# EAGLE design dmxshield (EAGLE 5.09)
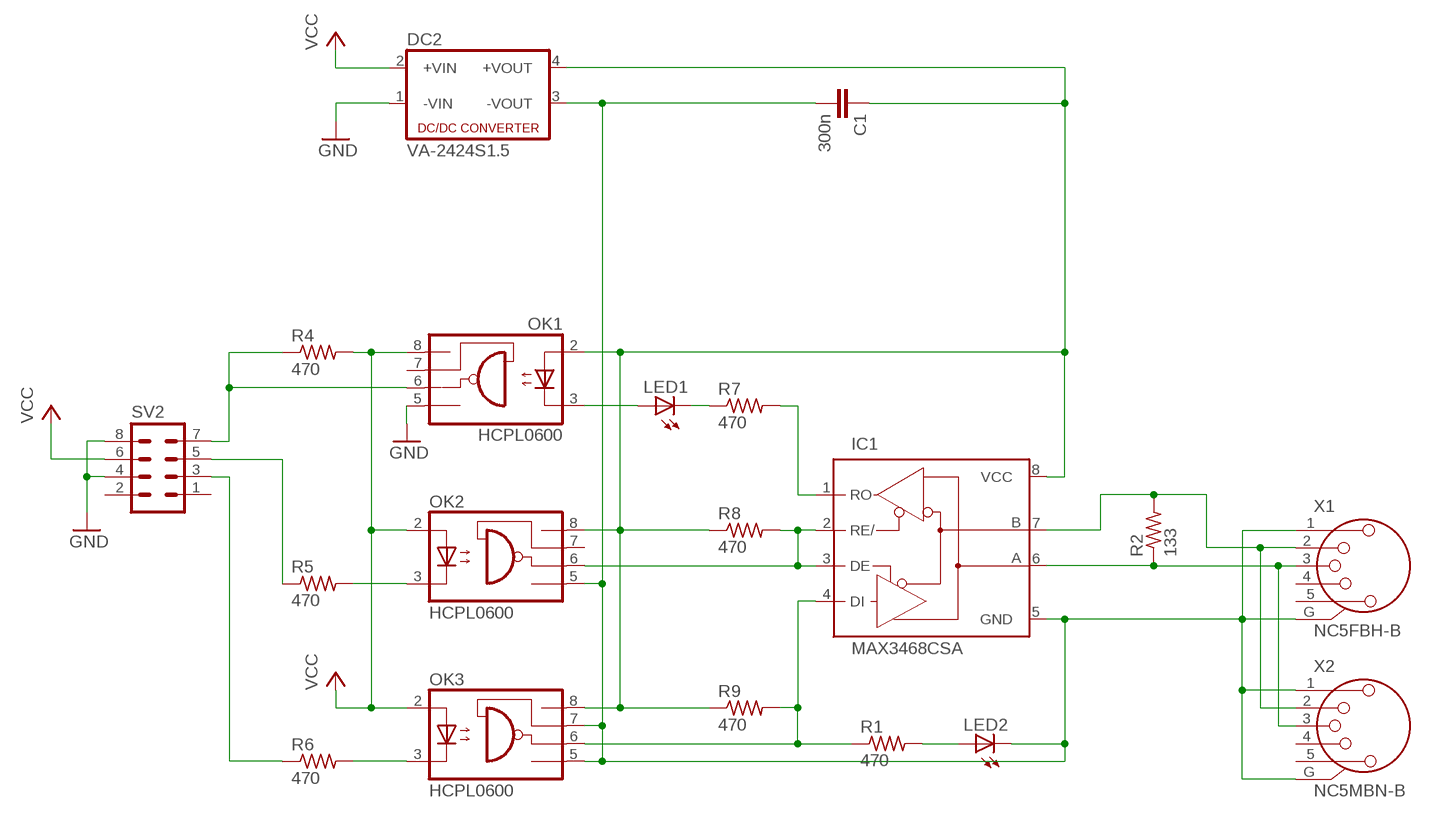
[diagram p0: schematic, sheet 1]

## Parts
C1  300n  C-EUC0805  [C0805]
DC2  VA-2424S1.5  [4SIL]
IC1  MAX3468CSA  [SO08]
LED1  LEDCHIP-LED0805  [CHIP-LED0805]
LED2  LEDCHIP-LED0805  [CHIP-LED0805]
OK1  HCPL0600  [SOIC08]
OK2  HCPL0600  [SOIC08]
OK3  HCPL0600  [SOIC08]
R1  470  R-US_R0805  [R0805]
R2  133  R-US_R0805  [R0805]
R4  470  R-US_R0805  [R0805]
R5  470  R-US_R0805  [R0805]
R6  470  R-US_R0805  [R0805]
R7  470  R-US_R0805  [R0805]
R8  470  R-US_R0805  [R0805]
R9  470  R-US_R0805  [R0805]
SV2  MA04-2  [MA04-2]
X1  NC5FBH-B  [NC5FBH-B]
X2  NC5MBN-B  [NC5MBH-B]

## Nets
GND: DC2.1(-VIN) OK1.5(GND) SV2.4 SV2.8
N$1: OK1.6(VO) R4.1 SV2.7
N$2: OK2.3(C) R5.2
N$3: R5.1 SV2.5
N$4: OK3.3(C) R6.2
N$5: LED1.A OK1.3(C)
N$6: C1.1 DC2.4(+VOUT) IC1.8(VCC) OK1.2(A) OK2.8(VCC) OK3.8(VCC) R8.1 R9.1
N$7: C1.2 DC2.3(-VOUT) IC1.5(GND) LED2.C OK2.5(GND) OK3.5(GND) OK3.7(VE) X1.1 X1.G X2.1 X2.G
N$8: IC1.2(RE/) IC1.3(DE) OK2.6(VO) R8.2
N$9: LED1.C R7.1
N$10: IC1.1(RO) R7.2
N$11: LED2.A R1.2
N$13: IC1.4(DI) OK3.6(VO) R1.1 R9.2
N$14: IC1.7(B) R2.2 X1.2 X2.2
N$15: IC1.6(A) R2.1 X1.3 X2.3
N$16: R6.1 SV2.3
VCC: DC2.2(+VIN) OK1.8(VCC) OK2.2(A) OK3.2(A) R4.2 SV2.6
Unconnected: OK1.7(VE) OK2.7(VE) SV2.1 SV2.2 X1.4 X1.5 X2.4 X2.5

## Library data of the parts
C1 = resistor:C-EU: CAPACITOR, European symbol
DC2 = dc-dc-converter:VA-*?: DC DC Converter Single Output, 1 Watt Motien Technology Co.,Ltd. Source: va-serie.pdf
IC1 = maxim:MAX34*: +5V, Fail-Safe, 40Mbps, Profibus RS-485/RS-422 Transceivers Source: MAX3465-MAX3469.pdf
LED1 LED2 = led:LED: LED OSRAM: - CHIPLED LG R971, LG N971, LY N971, LG Q971, LY Q971, LO R971, LY R971 LH N974, LH R974 LS Q976, LO Q976, LY Q976 LO Q996 - Hyper CHIPLED LW Q18S LB Q993, LB Q99A, LB R99A - SideLED LS A670, LO A670, LY A670, LG A670, LP A670 LB A673, LV A673, LT A673, LW A673 LH A674 LY A675 LS A676, LA A676, LO A676, LY A676, LW A676 LS A679, LY A679, LG A679 - Hyper Micro SIDELED® LS Y876, LA Y876, LO Y876, LY Y876 LT Y87S - SmartLED LW L88C, LW L88S LB L89C, LB L89S, LG L890 LS L89K, LO L89K, LY L89K LS L896, LA L896, LO L896, LY L896 - TOPLED LS T670, LO T670, LY T670, LG T670, LP T670 LSG T670, LSP T670, LSY T670, LOP T670, LYG T670 LG T671, LOG T671, LSG T671 LB T673, LV T673, LT T673, LW T673 LH T674 LS T676, LA T676, LO T676, LY T676, LB T676, LH T676, LSB T676, LW T676 LB T67C, LV T67C, LT T67C, LS T67K, LO T67K, LY T67K, LW E67C LS E67B, LA E67B, LO E67B, LY E67B, LB E67C, LV E67C, LT E67C LW T67C LS T679, LY T679, LG T679 LS T770, LO T770, LY T770, LG T770, LP T770 LB T773, LV T773, LT T773, LW T773 LH T774 LS E675, LA E675, LY E675, LS T675 LS T776, LA T776, LO T776, LY T776, LB T776 LHGB T686 LT T68C, LB T68C - Hyper Mini TOPLED® LB M676 - Mini TOPLED Santana® LG M470 LS M47K, LO M47K, LY M47K Source: http://www.osram.convergy.de LUXEON: - LUMILED® LXK2-PW12-R00, LXK2-PW12-S00, LXK2-PW14-U00, LXK2-PW14-V00 LXK2-PM12-R00, LXK2-PM12-S00, LXK2-PM14-U00 LXK2-PE12-Q00, LXK2-PE12-R00, LXK2-PE12-S00, LXK2-PE14-T00, LXK2-PE14-U00 LXK2-PB12-K00, LXK2-PB12-L00, LXK2-PB12-M00, LXK2-PB14-N00, LXK2-PB14-P00, LXK2-PB14-Q00 LXK2-PR12-L00, LXK2-PR12-M00, LXK2-PR14-Q00, LXK2-PR14-R00 LXK2-PD12-Q00, LXK2-PD12-R00, LXK2-PD12-S00 LXK2-PH12-R00, LXK2-PH12-S00 LXK2-PL12-P00, LXK2-PL12-Q00, LXK2-PL12-R00 Source: www.luxeon.com KINGBRIGHT: KA-3528ASYC Source: www.kingbright.com
OK1-OK3 = optocoupler:HCPL0600: HEWLETT PACKARD OPTO COUPLER
R1 R2 R4-R9 = resistor:R-US_: RESISTOR, American symbol
SV2 = con-lstb:MA04-2: PIN HEADER
X1 X2 = con-neutrik_ag:NC5: Neutrik Audio Connector XLR SERIES Stereo 1/4" jack Source: www.neutrik.com/

## Board
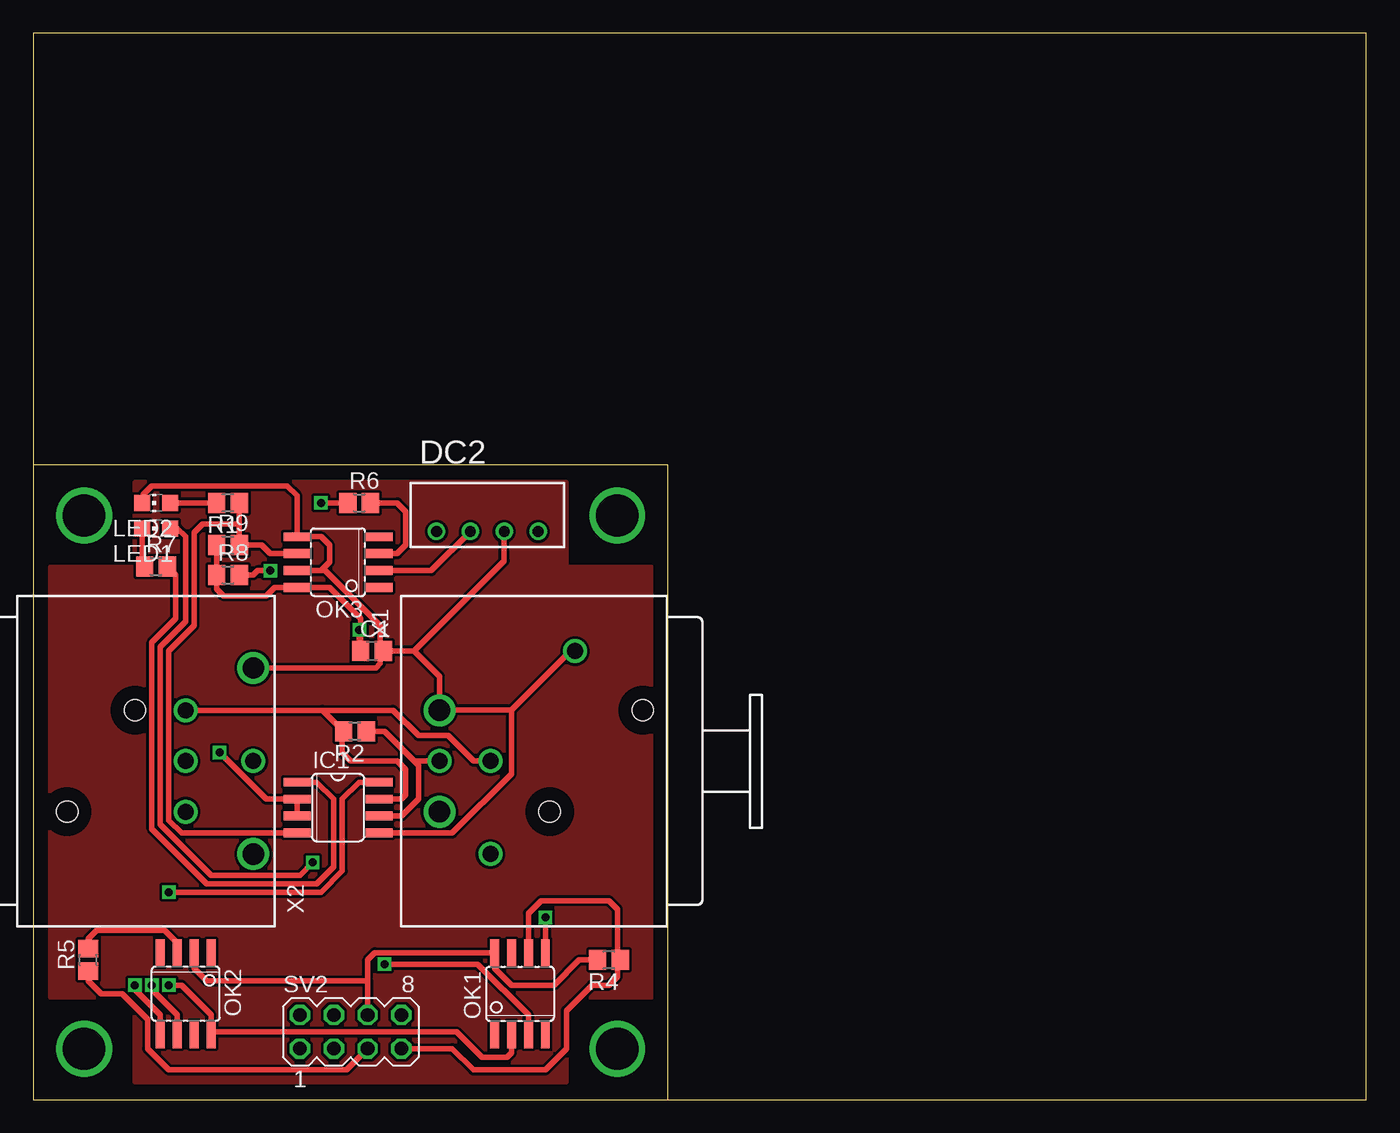
[diagram p1: board, top side]
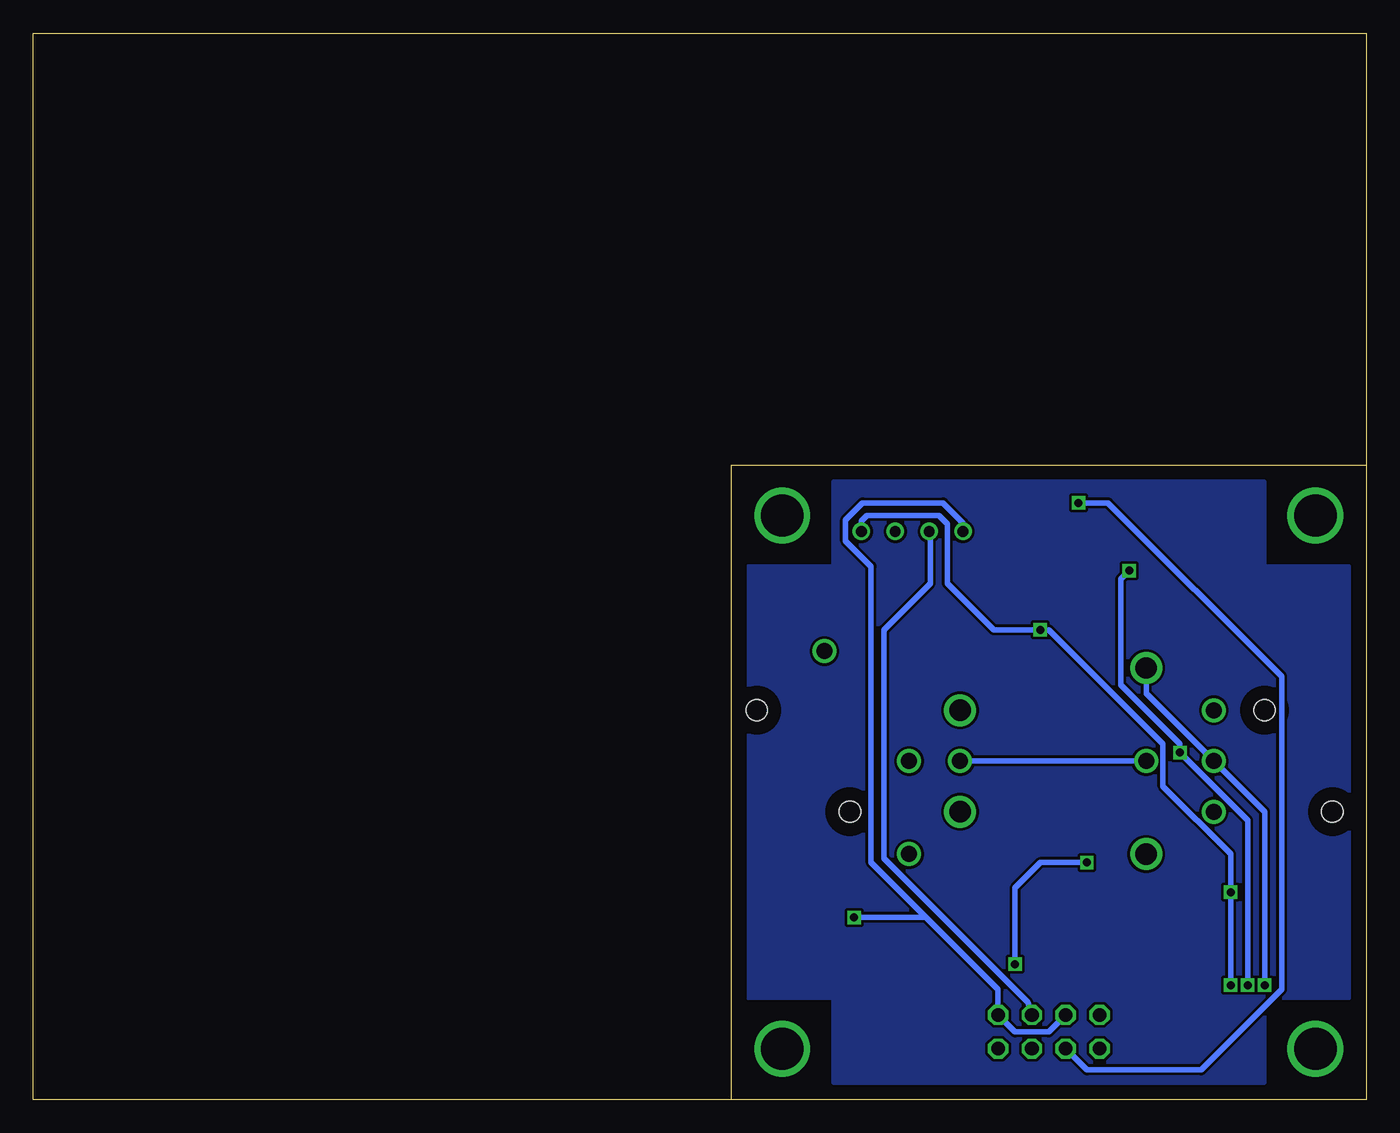
[diagram p2: board, bottom side, seen from below]

Size 100 x 80 mm. Coordinates in mm from the lower left corner, seen from the top.
Outline: 47.62,0 100,0 100,80 0,80 0,47.62
Outline: 47.62,0 0,0 0,47.62
Outline: 47.62,0 47.62,47.62 0,47.62
Copper layers (1*16): Top 0.035mm / dielectric 1.5mm / Bottom 0.035mm
Design rules "default": minimum track width 10mil, minimum drill 24mil, track to track 8mil, track to pad 8mil, pad to pad 8mil, via to via 8mil, smd to smd 8mil, copper to edge 40mil, drill to drill 8mil, minimum pad ring 10mil, minimum via ring 8mil, stop-mask expansion 4mil, vias tented up to drill 0mil, thermal gap 10mil
tKeepout: area 15.1,0.5 to 32.5,9.7

### Footprints (pad centres in the part's own frame; a part is rotated, then mirrored left to right if it is on the bottom)
C0805 = smd 1.3 x 1.5: 1 -0.85,0; 2 0.85,0
4SIL = drill 0.8 round: 1 -3.81,0; 2 -1.27,0; 3 1.27,0; 4 3.81,0
SO08 = smd 0.66 x 2.032: 1 -1.905,-3.073; 2 -0.635,-3.073; 3 0.635,-3.073; 4 1.905,-3.073; 5 1.905,3.073; 6 0.635,3.073; 7 -0.635,3.073; 8 -1.905,3.073
CHIP-LED0805 = smd 1.2 x 1.2: A 0,-1.05; C 0,1.05
SOIC08 = smd 0.66 x 2.032: 1 -1.905,-3.073; 2 -0.635,-3.073; 3 0.635,-3.073; 4 1.905,-3.073; 5 1.905,3.073; 6 0.635,3.073; 7 -0.635,3.073; 8 -1.905,3.073
R0805 = smd 1.3 x 1.5: 1 -0.85,0; 2 0.85,0
MA04-2 = drill 1.016 octagon: 1 -3.81,-1.27; 2 -3.81,1.27; 3 -1.27,-1.27; 4 -1.27,1.27; 5 1.27,-1.27; 6 1.27,1.27; 7 3.81,-1.27; 8 3.81,1.27
NC5FBH-B = drill 1.6 round: 1 -3.81,-3.815; 5 3.81,-3.815 | drill 1.2 round: 2 0,0; 3 0,-3.815; 4 6.98,0; G -8.25,6.355 | hole 1.6: 3.81,4.445; -3.81,11.43
NC5MBH-B = drill 1.6 round: 1 6.98,-5.08; 5 -6.98,-5.08 | drill 1.2 round: 2 3.81,0; 3 0,-5.08; 4 -3.81,0; G 0,0 | hole 1.6: 3.81,3.81; -3.81,8.89

### Placement (x,y rotation side)
C1  25.4,33.66 0 top
DC2  34.06,42.62 0 top
IC1  22.86,21.91 270 top
LED1  9.21,42.86 90 top
LED2  9.21,44.77 90 top
OK1  36.51,7.94 0 top
OK2  11.43,7.94 180 top
OK3  22.86,40.32 90 top
R1  14.61,44.77 180 top
R2  24.13,27.62 180 top
R4  43.18,10.48 180 top
R5  4.13,10.48 90 top
R6  24.45,44.77 0 top
R7  9.21,40.01 0 top
R8  14.61,39.37 0 top
R9  14.61,41.59 0 top
SV2  23.81,5.08 0 top
X1  34.29,25.4 270 top
X2  11.43,25.4 90 top

### Tracks (layer width: path | path; a pad name or v marks a point on that pad's centre or on a via)
GND  (via drill 0.6)
  Top 0.406: v38.42,13.65 OK1.5
  Bottom 0.406: SV2.4 23.81,5.08 26.35,5.08 SV2.8 27.62,8.26 33.02,13.65 | 33.02,13.65 v38.42,13.65 | DC2.1 30.25,43.27 31.75,44.77 37.78,44.77 39.05,43.5 39.05,41.91 37.15,40.01 37.15,17.78 33.02,13.65
MOUNT  (via drill 3.17 pad 3.17)
  other vias: 3.81,43.81 43.81,43.81 3.81,3.81 43.81,3.81
N$1
  Top 0.406: OK1.6 37.15,13.97 38.1,14.92 43.18,14.92 43.81,14.29 43.81,10.69 R4.1 43.81,10.26 43.81,9.21 43.18,8.57 41.91,8.57 40.01,6.67 40.01,3.81 38.42,2.22 33.02,2.22 31.43,3.81 SV2.7
N$2
  Top 0.406: OK2.3 10.79,11.75 9.84,12.7 4.76,12.7 4.13,12.06 R5.2
N$3
  Top 0.406: R5.1 4.13,8.89 5.08,7.94 6.67,7.94 8.57,6.03 8.57,3.81 10.16,2.22 23.5,2.22 SV2.5
N$4
  Top 0.406: R6.2 27.3,44.77 27.94,44.13 27.94,41.59 27.3,40.96 OK3.3
N$5  (via drill 0.6)
  Top 0.406: LED1.A 10.79,42.86 11.43,42.23 11.43,35.88 9.53,33.97 9.53,20.64 13.34,16.83 20,16.83 v20.95,17.78 | v26.35,10.16 33.34,10.16 37.15,6.35 OK1.3
  Bottom 0.406: v20.95,17.78 24.45,17.78 26.35,15.88 v26.35,10.16
N$6  (via drill 0.6)
  Top 0.406: R9.1 R8.1 13.76,38.31 14.29,37.78 17.46,37.78 18.1,38.42 OK3.8 22.23,38.42 24.55,36.09 C1.1 24.45,33.76 v24.45,35.24 | v10.16,8.57 11.11,8.57 13.34,6.35 OK2.8 13.55,5.08 31.75,5.08 33.66,3.17 35.56,3.17 35.88,3.49 OK1.2 | IC1.8 24.45,23.81 23.18,22.54 23.18,17.14 21.59,15.56 v10.16,15.56
  Bottom 0.406: DC2.4 37.87,43.41 37.47,43.81 32.07,43.81 31.43,43.18 31.43,38.73 27.94,35.24 v24.45,35.24 23.81,35.24 15.24,26.67 15.24,23.5 10.16,18.41 v10.16,15.56 v10.16,8.57
N$7  (via drill 0.6)
  Top 0.406: LED2.C 8.26,45.3 8.26,45.4 8.89,46.04 19.05,46.04 19.79,45.3 OK3.5 21.59,42.23 22.23,41.59 22.23,40.32 21.59,39.69 OK3.7 21.91,39.69 26.04,35.56 26.04,33.87 C1.2 | X2.1 25.71,32.38 26.04,32.7 26.04,33.44 C1.2 | X1.1 | 35.87,29.21 X1.1 | 35.87,29.21 35.88,29.21 35.88,24.45 31.43,20 IC1.5 | v7.62,8.57 7.62,8.26 9.53,6.35 OK2.5 | X1.1 30.48,31.75 28.57,33.66 | DC2.3 35.33,40.41 28.57,33.66 | X1.G 40.31,33.65 35.87,29.21 | 28.57,33.66 C1.2
  Bottom 0.406: v7.62,8.57 7.62,21.59 X2.G 16.51,30.48 X2.1
N$8  (via drill 0.6)
  Top 0.406: IC1.3 IC1.2 17.46,22.54 v13.97,26.04 | R8.2 16.51,39.37 16.83,39.69 v17.78,39.69 | v8.89,8.57 8.89,8.26 10.79,6.35 OK2.6
  Bottom 0.406: v17.78,39.69 18.41,39.05 18.41,31.11 13.97,26.67 v13.97,26.04 8.89,20.95 v8.89,8.57
N$9
  Top 0.406: LED1.C 8.16,40.2 R7.1
N$10
  Top 0.406: IC1.1 21.27,23.81 22.54,22.54 22.54,17.46 21.27,16.19 13.02,16.19 8.89,20.32 8.89,34.29 10.69,36.09 10.69,39.37 R7.2
N$11
  Top 0.406: R1.2 LED2.A
N$12
  pour Bottom: 1.27,7.62 1.27,40.01 7.62,40.01 7.62,46.35 40.01,46.35 40.01,40.01 46.35,40.01 46.35,7.62 40.01,7.62 40.01,1.27 7.62,1.27 7.62,7.62
N$13
  Top 0.406: 15.46,43.18 R9.2 17.14,41.59 17.78,40.96 OK3.6 | 15.46,43.18 R1.1 | 15.46,43.18 12.7,43.18 12.06,42.55 12.06,35.56 10.16,33.66 10.16,20.95 11.11,20 IC1.4
N$14
  Top 0.406: X2.2 21.69,29.21 | X1.2 33.02,25.4 31.11,27.3 28.89,27.3 26.99,29.21 21.69,29.21 | IC1.7 27.62,22.54 27.94,22.86 27.94,24.77 27.3,25.4 23.81,25.4 23.18,26.04 23.18,27.52 R2.2 21.69,29.21
N$15
  Top 0.406: IC1.6 27.62,21.27 28.89,22.54 28.89,25.08 28.57,25.4 | 28.57,25.4 26.35,27.62 R2.1 | X1.3 28.57,25.4
  Bottom 0.406: X2.3 X1.3
N$16  (via drill 0.6)
  Top 0.406: v21.59,44.77 R6.1
  Bottom 0.406: v21.59,44.77 19.37,44.77 6.35,31.75 6.35,8.26 12.38,2.22 20.95,2.22 SV2.3
N$17
  pour Top: 1.27,7.62 1.27,40.01 7.62,40.01 7.62,46.35 40.01,46.35 40.01,40.01 46.35,40.01 46.35,7.62 40.01,7.62 40.01,1.27 7.62,1.27 7.62,7.62
N$18  (via drill 0.6)
  other vias: 7.62,8.57
N$19  (via drill 0.6)
  other vias: 38.42,13.65
N$20  (via drill 0.6)
  other vias: 10.16,8.57
N$22  (via drill 0.6)
  other vias: 17.78,39.69
N$23  (via drill 0.6)
  other vias: 21.59,44.77
N$24  (via drill 0.6)
  other vias: 26.35,10.16
N$25  (via drill 0.6)
  other vias: 20.95,17.78
N$26  (via drill 0.6)
  other vias: 13.97,26.04
N$27  (via drill 0.6)
  other vias: 24.45,35.24
VCC
  Top 0.406: R4.2 40.96,10.48 39.05,8.57 35.88,8.57 34.61,9.84 OK1.8 25.62,11.01 25.08,10.48 25.08,8.89 | 25.08,8.89 SV2.6 | OK2.2 12.06,9.84 13.02,8.89 25.08,8.89 | OK3.2 29.86,39.69 DC2.2
  Bottom 0.406: SV2.6 25.4,7.3 36.2,18.1 36.2,35.24 32.7,38.73 32.7,42.53 DC2.2

### Text on the board
tTest: Gnd | V2 | V3 | 5.0V | V2 | 3.3V | Gnd | V3 | (C) 2012, Demand Peripherals, Inc. | IC1 | IC2 | IC3 | IC4 | R1 | R2 | R3 | R4 | C1 | C2 | C3 | C4 | 1 | 16 | PROTO, Rev A | 2 | 15 | 3 | 14 | 4 | 13 | 5 | 12 | 6 | 11 | 7 | 10 | 8 | BB4 | 9